# EAGLE design nivel_digital (EAGLE 9.6.2)
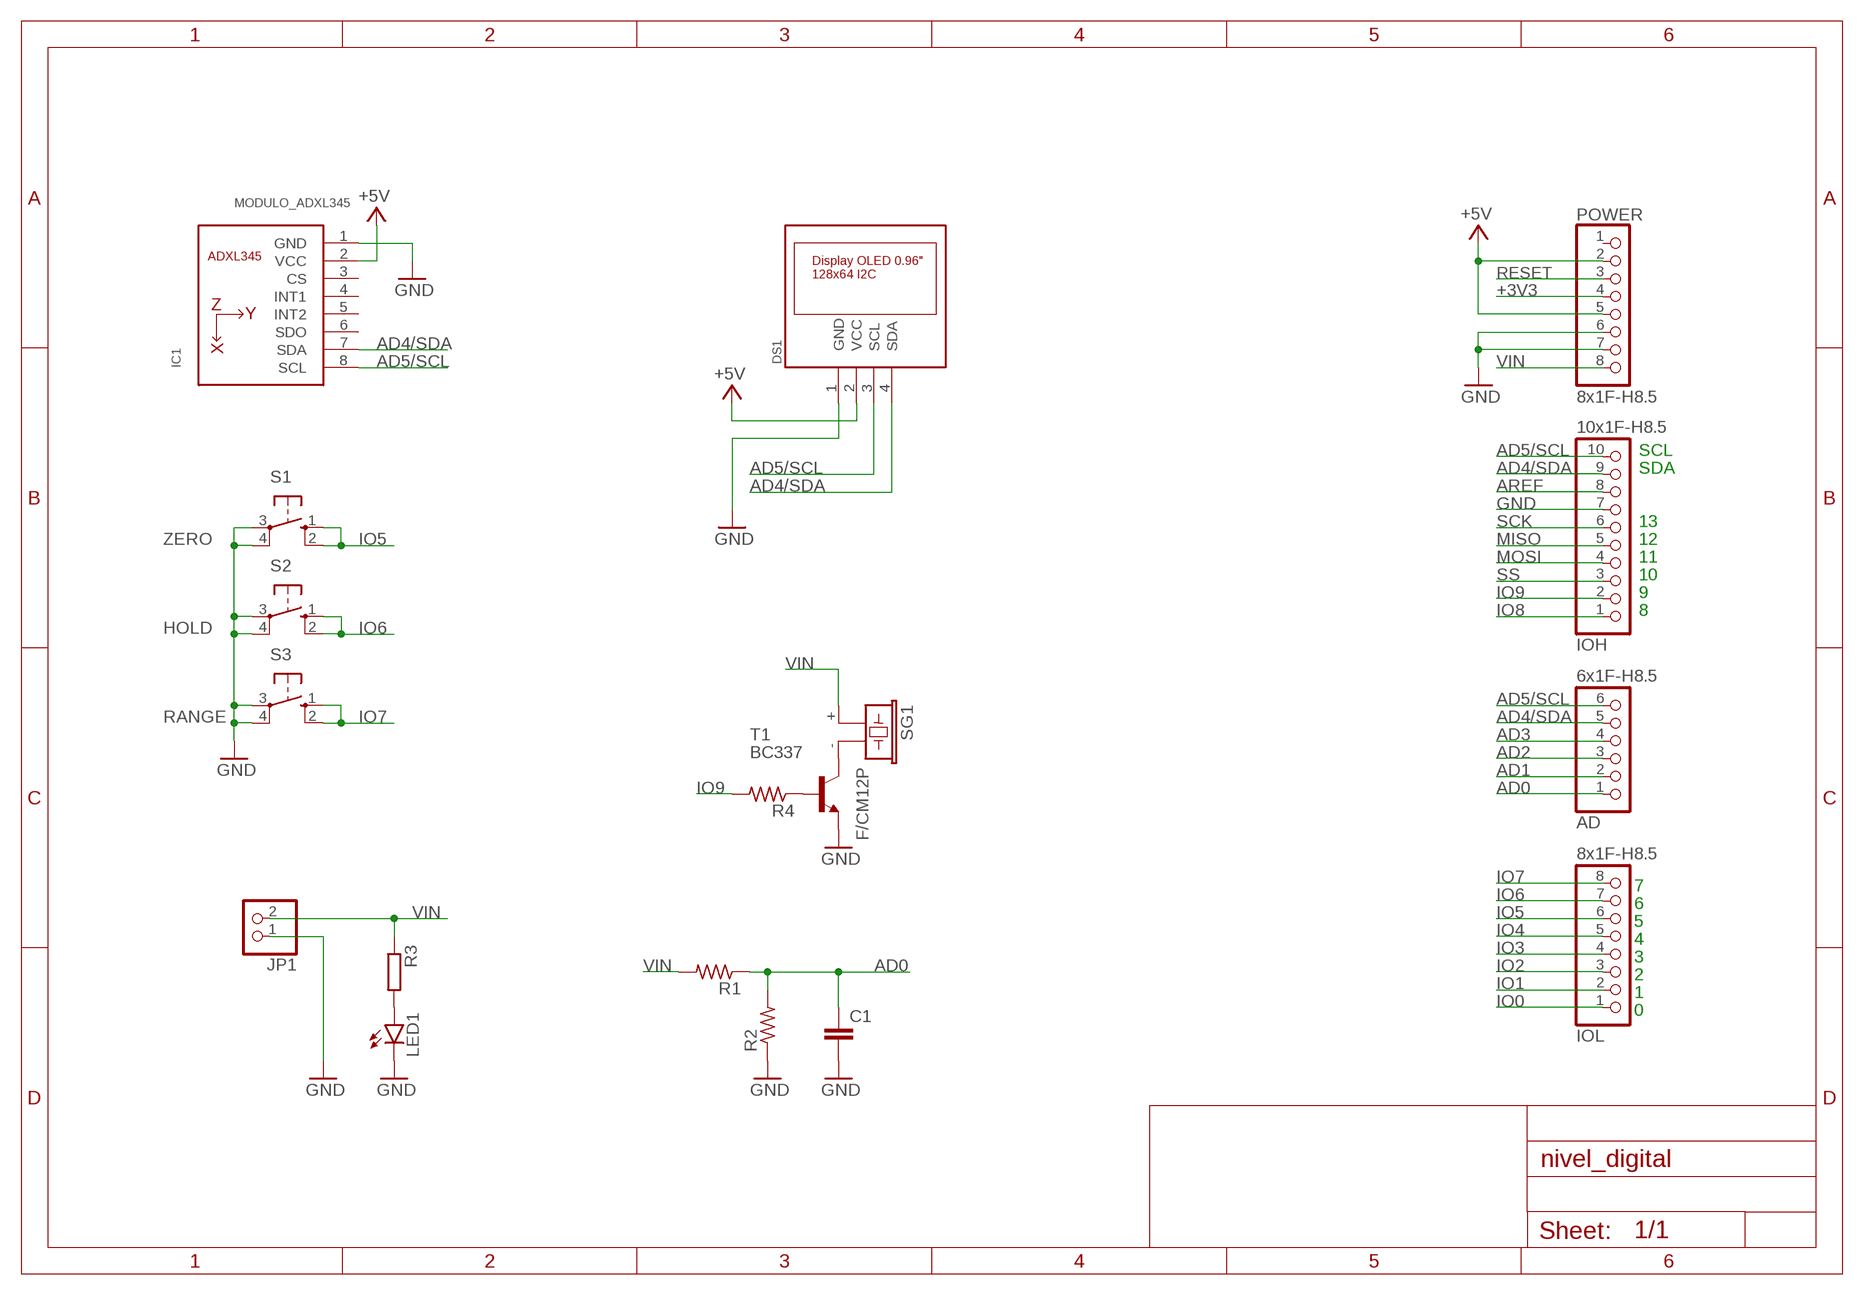
[diagram p0: schematic, sheet 1]

## Parts
AD  6x1F-H8.5  PINHD-1X6  [1X06]
C1  C-EU050-025X075  [C050-025X075]
DS1  OLED_0.96_I2C  [OLED_0.96_I2C]
IC1  MODULO_ADXL345  [MODULO_ADXL345]
IOH  10x1F-H8.5  PINHD-1X10_ARD  [1X10]
IOL  8x1F-H8.5  PINHD-1X8  [1X08]
JP1  PINHD-1X2/90  [1X02/90]
LED1  LED5MM  [LED5MM]
POWER  8x1F-H8.5  PINHD-1X8  [1X08]
R1  R-US_0204/7  [0204/7]
R2  R-US_0204/7  [0204/7]
R3  R-EU_0207/10  [0207/10]
R4  R-US_0204/7  [0204/7]
S1  10-XXPUSH-BUTTON-5MM  [B3F-10XX]
S2  10-XXPUSH-BUTTON-5MM  [B3F-10XX]
S3  10-XXPUSH-BUTTON-5MM  [B3F-10XX]
SG1  F/CM12P  [F/CM12P]
T1  BC337  [TO92]

## Nets
+3V3: POWER.4
+5V [usbvcc]: DS1.2(VCC) IC1.2(VCC) POWER.2 POWER.5
AD0: AD.1 C1.1 R1.1 R2.2
AD1: AD.2
AD2: AD.3
AD3: AD.4
AD4/SDA: AD.5 DS1.4(SDA) IC1.7(SDA) IOH.9
AD5/SCL: AD.6 DS1.3(SCL) IC1.8(SCL) IOH.10
AREF [aref]: IOH.8
GND [gnd]: C1.2 DS1.1(GND) IC1.1(GND) IOH.7 JP1.1 LED1.K(C) POWER.6 POWER.7 R2.1 S1.3(P) S1.4(P1) S2.3(P) S2.4(P1) S3.3(P) S3.4(P1) T1.1(E)
IO0: IOL.1
IO1: IOL.2
IO2: IOL.3
IO3: IOL.4
IO4: IOL.5
IO5: IOL.6 S1.1(S) S1.2(S1)
IO6: IOL.7 S2.1(S) S2.2(S1)
IO7: IOL.8 S3.1(S) S3.2(S1)
IO8: IOH.1
IO9: IOH.2 R4.2
MISO: IOH.5
MOSI: IOH.4
N$1: LED1.A R3.2
N$2: SG1.- T1.3(C)
N$3: R4.1 T1.2(B)
RESET: POWER.3
SCK: IOH.6
SS: IOH.3
VIN [power]: JP1.2 POWER.8 R1.2 R3.1 SG1.+
Unconnected: IC1.3(CS) IC1.4(INT1) IC1.5(INT2) IC1.6(SDO) POWER.1

## Notes on the sheet
- SCL
- SDA
- 13
- ZERO | 12
- 11
- 10
- 9
- 8
- HOLD
- RANGE
- 7
- 6
- 5
- 4
- 3
- 2
- 1
- 0

## Library data of the parts
AD = SmartPrj:PINHD-1X6: PIN HEADER
C1 = rcl:C-EU: CAPACITOR, European symbol; SPICEPREFIX: C
DS1 = GEAP:OLED_0.96_I2C: Display gráfico OLED 0.96" com comunicação I2C. Resolução: 128x64 pixels Alimentação: 5V Endereço I2C: 0x78
IC1 = GEAP:MODULO_ADXL345: O Módulo Acelerômetro ADXL345 3 Eixos é módulo acelerômetro de alta resolução (13-bits) de medição de até ± 16 g, com interface I2C e SPI o que o torna compatível com a maioria dos microcontroladores como Arduino, PIC, Raspberry e etc. Pode ser usado para obter dados de inclinação, choques, tremores e etc.
IOH = SmartPrj:PINHD-1X10_ARD: PIN HEADER
IOL POWER = SmartPrj:PINHD-1X8: PIN HEADER
JP1 = pinhead:PINHD-1X2: PIN HEADER
LED1 = led:LED: LED OSRAM: - CHIPLED LG R971, LG N971, LY N971, LG Q971, LY Q971, LO R971, LY R971 LH N974, LH R974 LS Q976, LO Q976, LY Q976 LO Q996 - Hyper CHIPLED LW Q18S LB Q993, LB Q99A, LB R99A - SideLED LS A670, LO A670, LY A670, LG A670, LP A670 LB A673, LV A673, LT A673, LW A673 LH A674 LY A675 LS A676, LA A676, LO A676, LY A676, LW A676 LS A679, LY A679, LG A679 - Hyper Micro SIDELED® LS Y876, LA Y876, LO Y876, LY Y876 LT Y87S - SmartLED LW L88C, LW L88S LB L89C, LB L89S, LG L890 LS L89K, LO L89K, LY L89K LS L896, LA L896, LO L896, LY L896 - TOPLED LS T670, LO T670, LY T670, LG T670, LP T670 LSG T670, LSP T670, LSY T670, LOP T670, LYG T670 LG T671, LOG T671, LSG T671 LB T673, LV T673, LT T673, LW T673 LH T674 LS T676, LA T676, LO T676, LY T676, LB T676, LH T676, LSB T676, LW T676 LB T67C, LV T67C, LT T67C, LS T67K, LO T67K, LY T67K, LW E67C LS E67B, LA E67B, LO E67B, LY E67B, LB E67C, LV E67C, LT E67C LW T67C LS T679, LY T679, LG T679 LS T770, LO T770, LY T770, LG T770, LP T770 LB T773, LV T773, LT T773, LW T773 LH T774 LS E675, LA E675, LY E675, LS T675 LS T776, LA T776, LO T776, LY T776, LB T776 LHGB T686 LT T68C, LB T68C - Hyper Mini TOPLED® LB M676 - Mini TOPLED Santana® LG M470 LS M47K, LO M47K, LY M47K Source: http://www.osram.convergy.de LUXEON: - LUMILED® LXK2-PW12-R00, LXK2-PW12-S00, LXK2-PW14-U00, LXK2-PW14-V00 LXK2-PM12-R00, LXK2-PM12-S00, LXK2-PM14-U00 LXK2-PE12-Q00, LXK2-PE12-R00, LXK2-PE12-S00, LXK2-PE14-T00, LXK2-PE14-U00 LXK2-PB12-K00, LXK2-PB12-L00, LXK2-PB12-M00, LXK2-PB14-N00, LXK2-PB14-P00, LXK2-PB14-Q00 LXK2-PR12-L00, LXK2-PR12-M00, LXK2-PR14-Q00, LXK2-PR14-R00 LXK2-PD12-Q00, LXK2-PD12-R00, LXK2-PD12-S00 LXK2-PH12-R00, LXK2-PH12-S00 LXK2-PL12-P00, LXK2-PL12-Q00, LXK2-PL12-R00 Source: www.luxeon.com KINGBRIGHT: KA-3528ASYC Source: www.kingbright.com
R1 R2 R4 = rcl:R-US_: RESISTOR, American symbol; SPICEPREFIX: R
R3 = rcl:R-EU_: RESISTOR, European symbol; SPICEPREFIX: R
S1-S3 = GEAP:10-XX: OMRON SWITCH
SG1 = buzzer:F/CM12P: BUZZER Source: Buerklin; OC_FARNELL: unknown; OC_NEWARK: unknown
T1 = transistor:BC337: NPN TRANSISTOR

## Net classes
0 default: width 0.254 mm, clearance 0.254 mm
1 power: width 0.61 mm, drill 0.61 mm, clearance 0.254 mm
2 gnd: width 0.305 mm, drill 0.559 mm, clearance 0.254 mm
3 usbvcc: width 0.508 mm, drill 0.61 mm, clearance 0.254 mm
4 aref: width 0.406 mm, drill 0.61 mm, clearance 0.254 mm

## Board
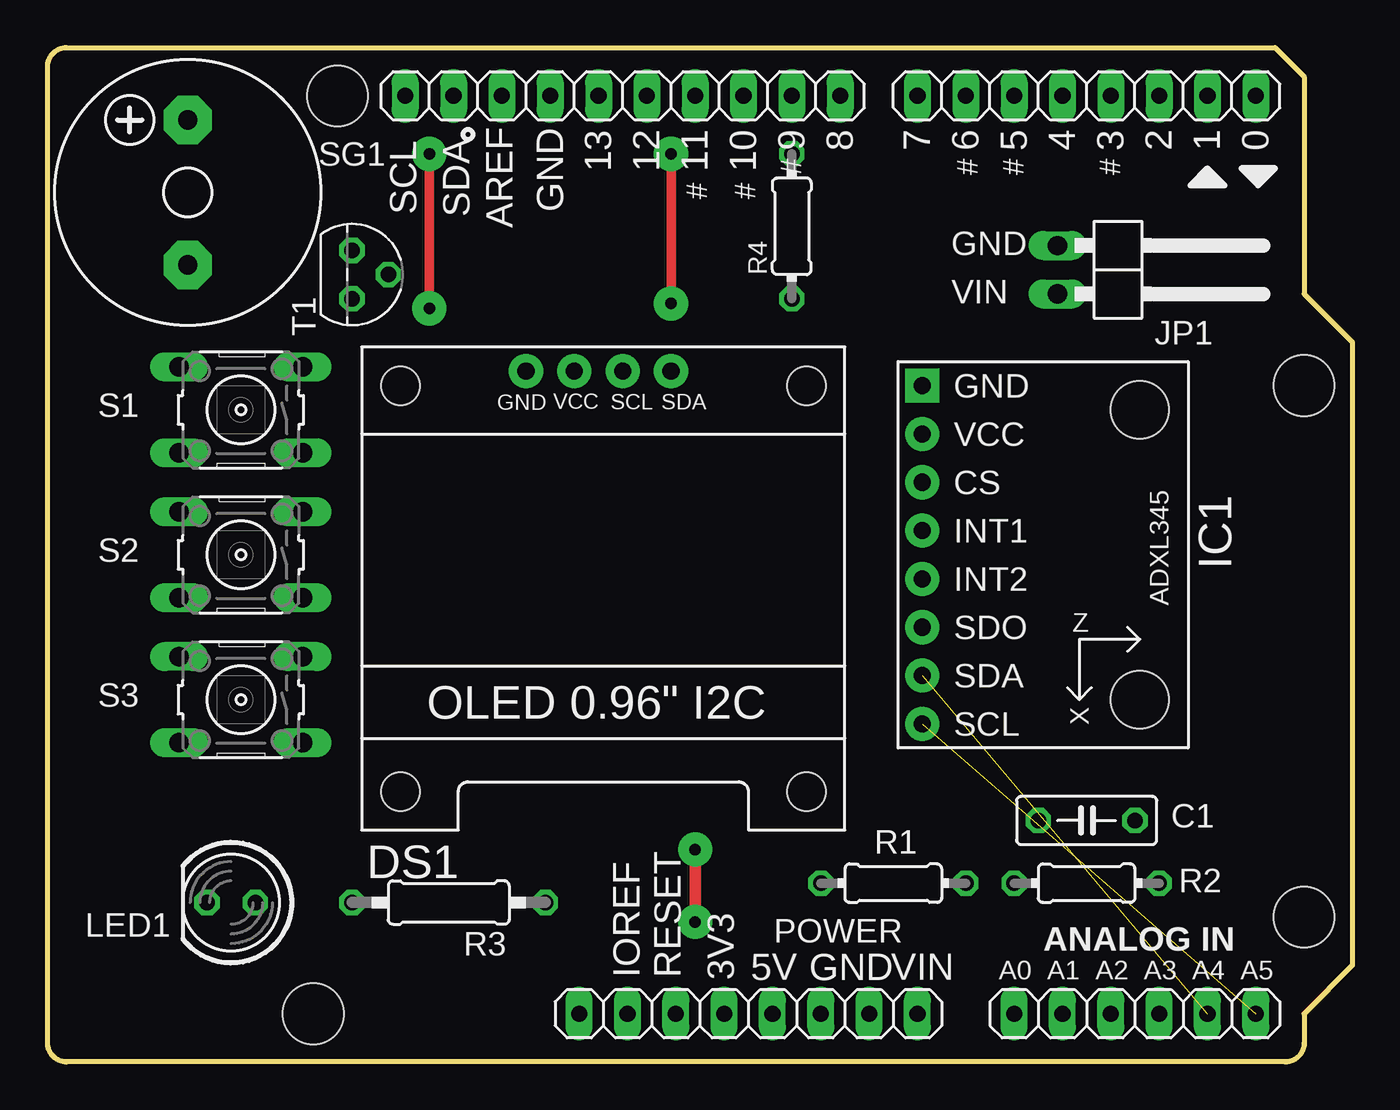
[diagram p1: board, top side]
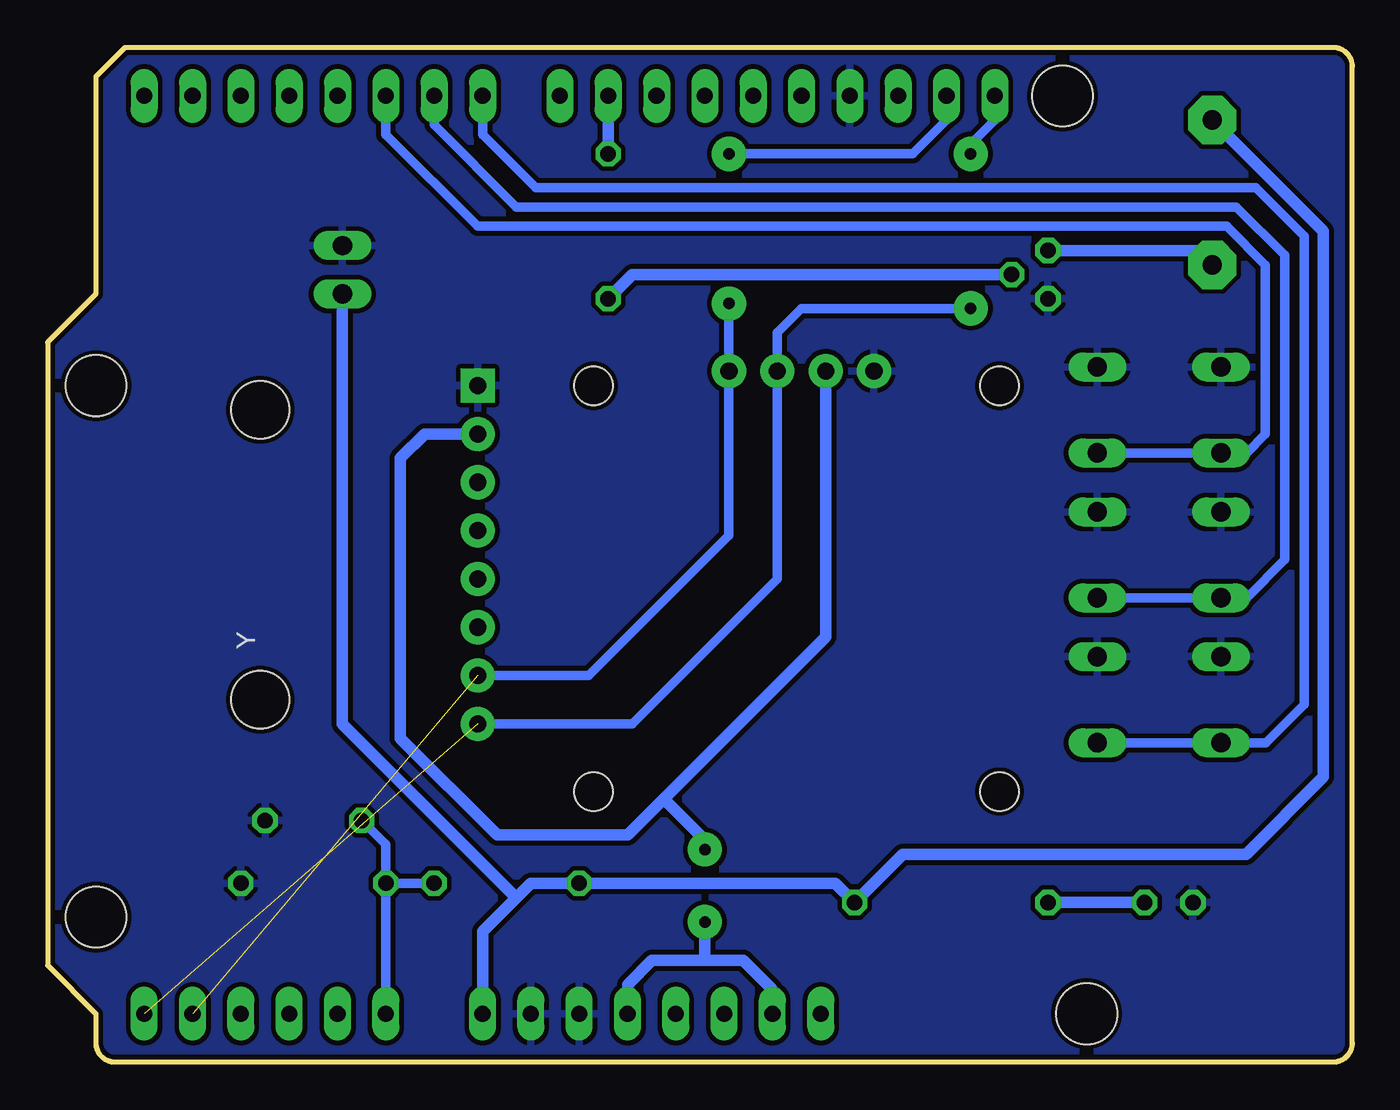
[diagram p2: board, bottom side, seen from below]

Size 68.58 x 53.34 mm. Coordinates in mm from the lower left corner, seen from the top.
Outline: 64.52,53.34 66.04,51.82 66.04,40.39 68.58,37.85 68.58,5.08 66.04,2.54 66.04,1 arc-90 65.04,0 1,0 arc-90 0,1 0,52.34 arc-90 1,53.34 64.52,53.34
Copper layers (1*16): Top 0.035mm / dielectric 1.5mm / Bottom 0.035mm
Design rules "default *": minimum track width 6mil, minimum drill 0.35mm, track to track 6mil, track to pad 6mil, pad to pad 6mil, via to via 6mil, smd to smd 6mil, copper to edge 10mil, drill to drill 6mil, minimum pad ring 10mil, minimum via ring 8mil, stop-mask expansion 4mil, vias tented up to drill 0mil, thermal gap 10mil
Holes 3.2 mm at 66.04,35.56 66.04,7.62 15.24,50.8 13.97,2.54
vRestrict: area 22.9,44.1 to 24.6,49.1; area 25.4,45.5 to 27.1,49.1; area 28.4,45.3 to 29.6,48.8; area 31,45.3 to 32.1,48.8; area 33.5,45.3 to 34.7,48.8; area 36.1,45.3 to 37.2,48.8; area 38.7,47.2 to 39.9,48.8; area 40.3,45.1 to 47.6,46.9; area 60.3,44.2 to 61.7,46.7; area 62.9,44.2 to 64.3,46.7; area 61.3,35.8 to 64.8,37.2; area 0.6,21.8 to 2,30.1; 14 more areas

### Footprints (pad centres in the part's own frame; a part is rotated, then mirrored left to right if it is on the bottom)
1X06 = drill 0.85 pad 1.422 long: 1 -6.35,0; 2 -3.81,0; 3 -1.27,0; 4 1.27,0; 5 3.81,0; 6 6.35,0
C050-025X075 = drill 0.813 octagon: 1 -2.54,0; 2 2.54,0
OLED_0.96_I2C = drill 0.9 pad 1.8: 1 -4.064,11.43; 2 -1.524,11.43; 3 1.016,11.43; 4 3.556,11.43 | hole 2.032: -10.668,10.668; -10.668,-10.668; 10.668,-10.668; 10.668,10.668
MODULO_ADXL345 = drill 0.9 pad 1.8 square: 1 1.27,19.05 | drill 0.9 pad 1.8: 2 1.27,16.51; 3 1.27,13.97; 4 1.27,11.43; 5 1.27,8.89; 6 1.27,6.35; 7 1.27,3.81; 8 1.27,1.27 | hole 3.048: 12.7,17.78; 12.7,2.54
1X10 = drill 0.85 pad 1.422 long: 1 -11.43,0; 2 -8.89,0; 3 -6.35,0; 4 -3.81,0; 5 -1.27,0; 6 1.27,0; 7 3.81,0; 8 6.35,0; 9 8.89,0; 10 11.43,0
1X08 = drill 0.85 pad 1.422 long: 1 -8.89,0; 2 -6.35,0; 3 -3.81,0; 4 -1.27,0; 5 1.27,0; 6 3.81,0; 7 6.35,0; 8 8.89,0
1X02/90 = drill 1.016 long: 1 -1.27,-3.81; 2 1.27,-3.81
LED5MM = drill 0.813 octagon: A -1.27,0; K 1.27,0
0204/7 = drill 0.813 octagon: 1 -3.81,0; 2 3.81,0
0207/10 = drill 0.813 octagon: 1 -5.08,0; 2 5.08,0
B3F-10XX = drill 1.016 long: 1 -3.251,2.261; 2 3.251,2.261; 3 -3.251,-2.261; 4 3.251,-2.261
F/CM12P = drill 1.016 pad 2.54 octagon: + 3.81,0; - -3.81,0
TO92 = drill 0.813 octagon: 1 1.27,0; 2 0,1.905; 3 -1.27,0

### Placement (x,y rotation side)
AD  57.15,2.54 0 top
C1  54.61,12.7 0 top
DS1  29.21,24.89 0 top
IC1  44.7,16.51 0 top
IOH  30.23,50.8 180 top
IOL  54.61,50.8 180 top
JP1  56.9,41.66 270 top
LED1  9.65,8.38 180 top
POWER  36.83,2.54 0 top
R1  44.45,9.4 180 top
R2  54.61,9.4 180 top
R3  21.08,8.38 180 top
R4  39.12,43.94 90 top
S1  10.16,34.29 180 top
S2  10.16,26.67 180 top
S3  10.16,19.05 180 top
SG1  7.37,45.72 90 top
T1  16,41.4 270 top

### Tracks (layer width: path | path; a pad name or v marks a point on that pad's centre or on a via)
+5V  (via drill 0.61 pad 1.78)
  Top 0.61: v34.04,7.37 v34.04,11.18
  Bottom 0.61: 36.2,13.84 38.1,11.94 44.96,11.94 50.04,17.02 50.04,31.75 48.77,33.02 IC1.2 | 36.2,13.84 27.69,22.35 DS1.2 | POWER.5 38.1,4.06 36.83,5.33 34.04,5.33 | 34.04,5.33 32,5.33 30.48,3.81 POWER.2 | 34.04,5.33 v34.04,7.37 | v34.04,11.18 34.04,11.68 36.2,13.84
AD0
  Bottom 0.508: R2.2 R1.1 | R2.2 50.8,11.43 C1.1 | AD.1 R2.2
AD4/SDA  (via drill 0.6 pad 1.8)  (1 unrouted)
  Top 0.508: v32.77,47.75 v32.77,39.88
  Bottom 0.508: IOH.9 21.34,49.53 23.11,47.75 v32.77,47.75 | v32.77,39.88 DS1.4 32.77,27.69 40.13,20.32 IC1.7
AD5/SCL  (via drill 0.6 pad 1.8)  (1 unrouted)
  Top 0.508: v20.07,47.75 v20.07,39.62
  Bottom 0.508: IOH.10 18.8,49.53 20.07,48.26 v20.07,47.75 | v20.07,39.62 28.96,39.62 30.23,38.35 DS1.3 30.23,25.4 37.85,17.78 IC1.8
GND
  pour Bottom (isolate 0.254): 1,0 arc-90 0,1 0,52.34 arc-90 1,53.34 64.52,53.34 66.04,51.82 66.04,40.39 68.58,37.85 68.58,5.08 66.04,2.54 66.04,1 arc-90 65.04,0
IO5
  Bottom 0.508: IOL.6 50.8,48.77 45.97,43.94 6.6,43.94 4.57,41.91 4.57,33.02 5.56,32.03 S1.2 S1.1
IO6
  Bottom 0.508: IOL.7 48.26,49.28 43.94,44.96 6.1,44.96 3.56,42.42 3.56,26.42 5.56,24.41 S2.2 S2.1
IO7
  Bottom 0.508: IOL.8 45.72,48.77 42.93,45.97 5.08,45.97 2.54,43.43 2.54,18.8 4.55,16.79 S3.2 S3.1
IO9
  Bottom 0.61: IOH.2 R4.2
N$1
  Bottom 0.61: LED1.A R3.2
N$2
  Bottom 0.61: T1.3 8.13,42.67 SG1.-
N$3
  Bottom 0.61: R4.1 37.85,41.4 T1.2
VIN
  Bottom 0.61: JP1.2 53.09,17.78 43.94,8.64 | 43.94,8.64 43.18,9.4 R1.2 27.18,9.4 R3.1 23.62,10.92 5.59,10.92 1.52,14.99 1.52,43.69 SG1.+ | POWER.8 45.72,6.86 43.94,8.64

### Text on the board
tPlace: 13 | 12 | 11 | 10 | 9 | 8 | 7 | 6 | 5 | 4 | 3 | 2 | 1 | 0 | GND | VIN
tNames: AREF | GND | # | # | # | # | SCL | # | # | SDA | ANALOG IN | IOREF | RESET | 3V3 | 5V | GND | VIN | A0 | A1 | A2 | A3 | A4 | A5
ReferenceLC: L | PC1 | PC2
214bmp: D:/SmartProjects/Snc/a4_bn_logo2.bmp